# Altium schematic sheet Buttons_SCHEMATIC.SchDoc
size A4; SheetNumber: 4; SheetTotal: 5
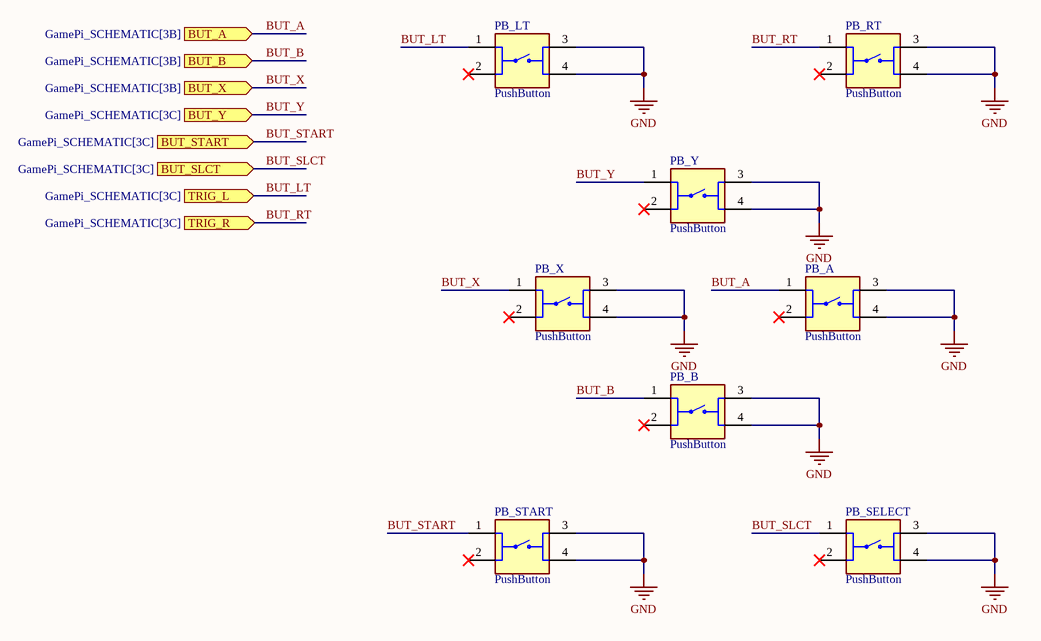
[diagram p0: Buttons_SCHEMATIC.SchDoc]

## Parts
PB_A  PushButton  [Push Button]
PB_B  PushButton  [Push Button]
PB_LT  PushButton  [Push Button]
PB_RT  PushButton  [Push Button]
PB_SELECT  PushButton  [Push Button]
PB_START  PushButton  [Push Button]
PB_X  PushButton  [Push Button]
PB_Y  PushButton  [Push Button]

## Ports
BUT_A (in, see GamePi_SCHEMATIC[3B]), BUT_B (in, see GamePi_SCHEMATIC[3B]), BUT_SLCT (in, see GamePi_SCHEMATIC[3C]), BUT_START (in, see GamePi_SCHEMATIC[3C]), BUT_X (in, see GamePi_SCHEMATIC[3B]), BUT_Y (in, see GamePi_SCHEMATIC[3C]), TRIG_L (in, see GamePi_SCHEMATIC[3C]), TRIG_R (in, see GamePi_SCHEMATIC[3C])

## Nets
GND: PB_A.3 PB_A.4 PB_B.3 PB_B.4 PB_LT.3 PB_LT.4 PB_RT.3 PB_RT.4 PB_SELECT.3 PB_SELECT.4 PB_START.3 PB_START.4 PB_X.3 PB_X.4 PB_Y.3 PB_Y.4
BUT_A: PB_A.1 ; port BUT_A
BUT_B: PB_B.1 ; port BUT_B
BUT_LT: PB_LT.1 ; port TRIG_L
BUT_RT: PB_RT.1 ; port TRIG_R
BUT_SLCT: PB_SELECT.1 ; port BUT_SLCT
BUT_START: PB_START.1 ; port BUT_START
BUT_X: PB_X.1 ; port BUT_X
BUT_Y: PB_Y.1 ; port BUT_Y

Not connected (* = marked no-connect by the designer): PB_A 2*; PB_B 2*; PB_LT 2*; PB_RT 2*; PB_SELECT 2*; PB_START 2*; PB_X 2*; PB_Y 2*